# EAGLE design MI0283QT_v13 (EAGLE 6.6.0)
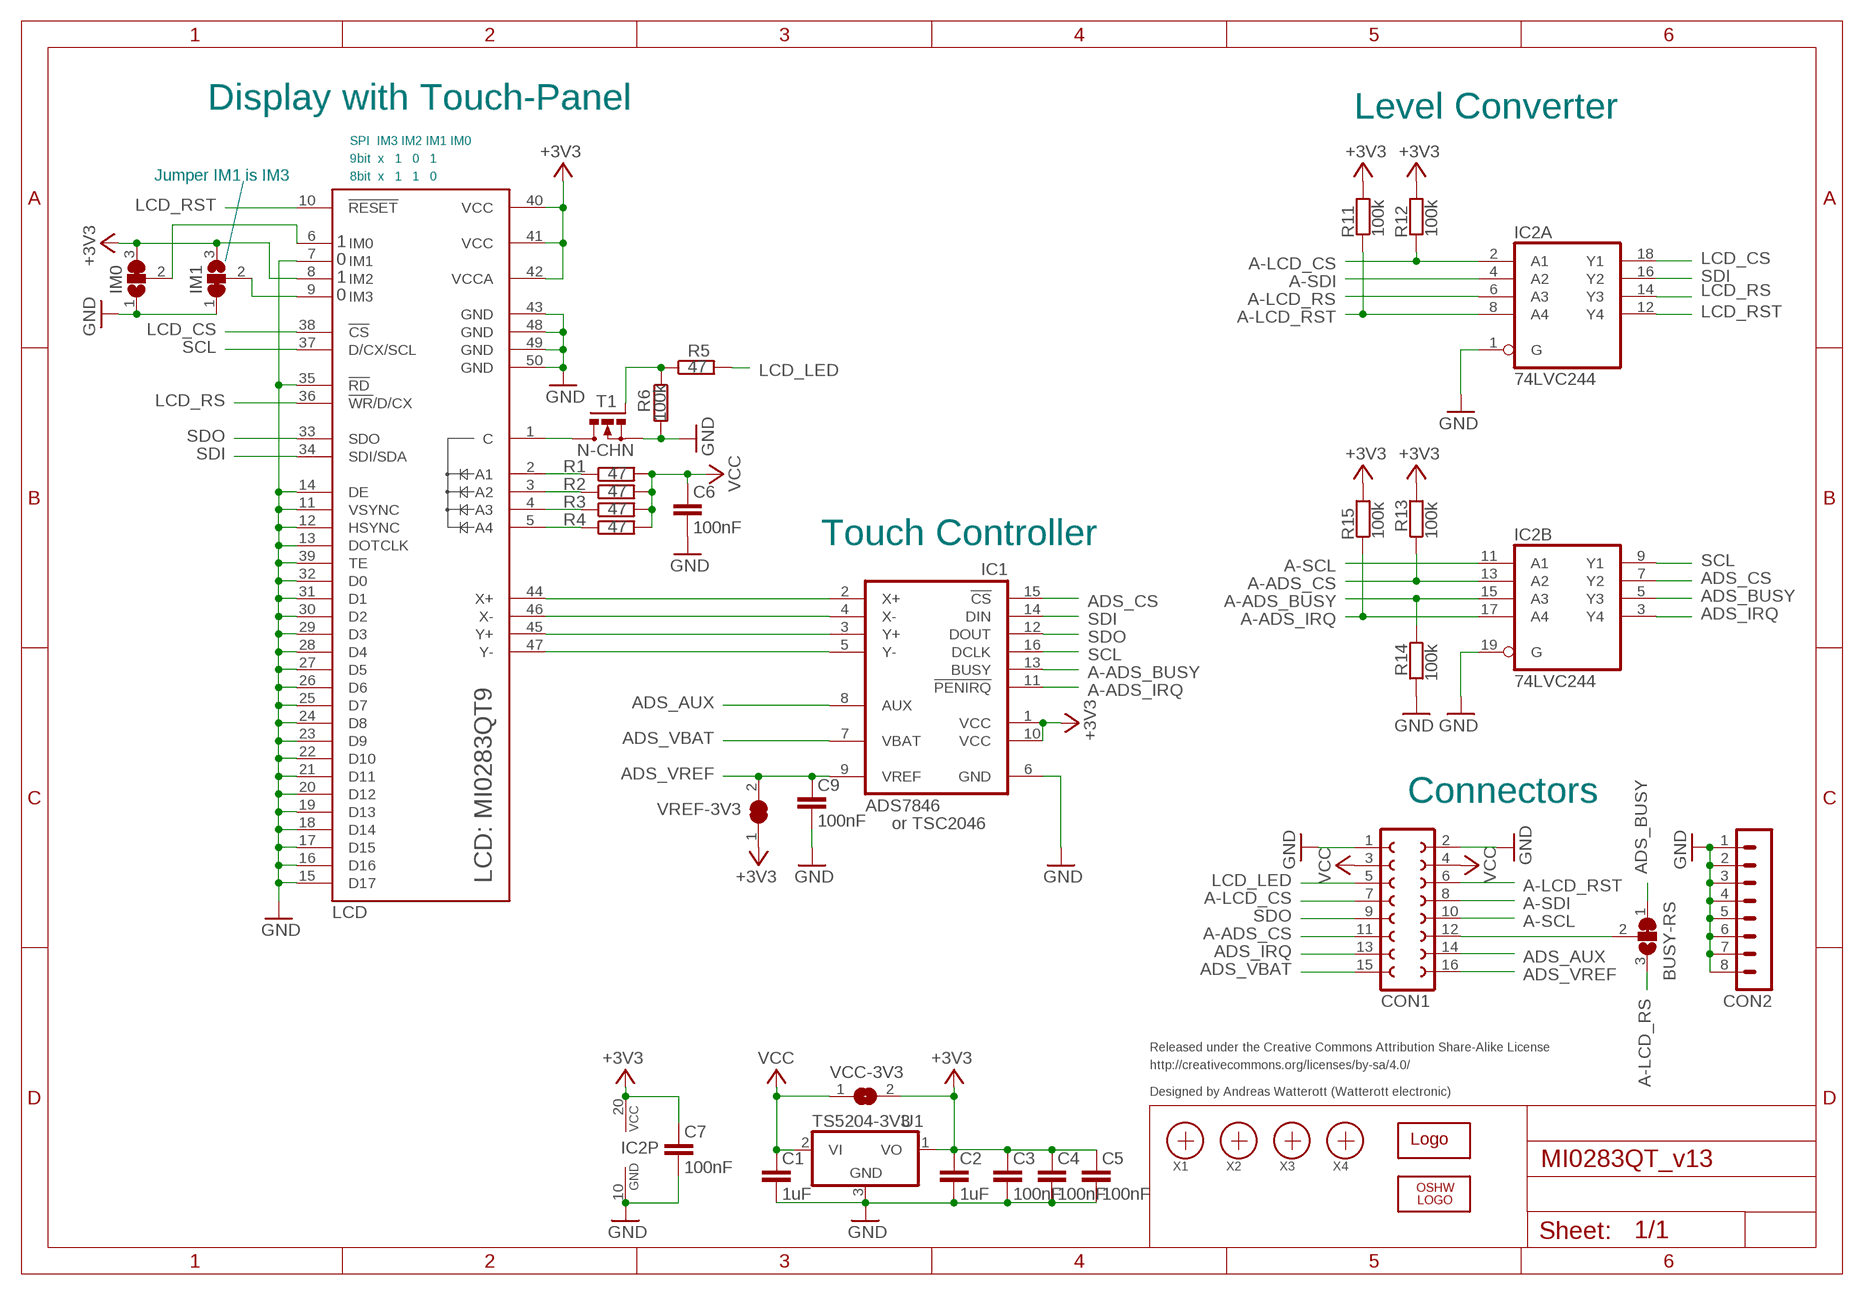
[diagram p0: schematic, sheet 1]

## Parts
BUSY-RS  SJ2W  [SJ_2]
C1  1uF  C-EUC0603  [C0603]
C2  1uF  C-EUC0603  [C0603]
C3  100nF  C-EUC0603  [C0603]
C4  100nF  C-EUC0603  [C0603]
C5  100nF  C-EUC0603  [C0603]
C6  100nF  C-EUC0603  [C0603]
C7  100nF  C-EUC0603  [C0603]
C9  100nF  C-EUC0603  [C0603]
CON1  FE08-2  [FE08-2]
CON2  MA08-1  [MA08-1]
IC1  ADS7846  [SSOP16]
IC2  74LVC244  74HC244DW  [SO20W]
IM0  SJ2W  [SJ_2]
IM1  SJ2W  [SJ_2]
LCD  MI0283QT9  [MI0283QT9]
LOGO1  OSHW_LOGO_6MILX0150-NT  [OSHW_6X150_NOTEXT]
R1  47  R-EU_R0603  [R0603]
R2  47  R-EU_R0603  [R0603]
R3  47  R-EU_R0603  [R0603]
R4  47  R-EU_R0603  [R0603]
R5  47  R-EU_R0603  [R0603]
R6  100k  R-EU_R0603  [R0603]
R11  100k  R-EU_R0603  [R0603]
R12  100k  R-EU_R0603  [R0603]
R13  100k  R-EU_R0603  [R0603]
R14  100k  R-EU_R0603  [R0603]
R15  100k  R-EU_R0603  [R0603]
T1  N-CHN  IRLML2502  [MICRO3]
U1  TS5204-3V3  TS5204  [SOT23]
U$1  WE-LOGO  WE-LOGOPLACE  [WE-LOGO]
VCC-3V3  SJ  [SJ]
VREF-3V3  SJ  [SJ]
X1  PASSER  [PASSER]
X2  PASSER  [PASSER]
X3  PASSER  [PASSER]
X4  PASSER  [PASSER]

## Nets
+3V3: C2.1 C3.1 C4.1 C5.1 C7.1 IC1.1(VCC) IC1.10(VCC) IC2.20(P:VCC) IM0.3 IM1.3 LCD.8(IM2) LCD.40(VCC) LCD.41(VCC) LCD.42(VCCA) R11.2 R12.2 R13.2 R15.2 U1.1(VO) VCC-3V3.2 VREF-3V3.1
A-ADS_BUSY: IC1.13(BUSY) IC2.15(B:A3) R14.1
A-ADS_CS: CON1.11 IC2.13(B:A2) R13.1
A-ADS_IRQ: IC1.11(!PENIRQ) IC2.17(B:A4) R15.1
A-LCD_CS: CON1.7 IC2.2(A:A1) R12.1
A-LCD_RS: BUSY-RS.3 IC2.6(A:A3)
A-LCD_RST: CON1.6 IC2.8(A:A4) R11.1
A-SCL: CON1.10 IC2.11(B:A1)
A-SDI: CON1.8 IC2.4(A:A2)
ADS_AUX: CON1.14 IC1.8(AUX)
ADS_BUSY: BUSY-RS.1 IC2.5(B:Y3)
ADS_CS: IC1.15(!CS) IC2.7(B:Y2)
ADS_IRQ: CON1.13 IC2.3(B:Y4)
ADS_VBAT: CON1.15 IC1.7(VBAT)
ADS_VREF: C9.1 CON1.16 IC1.9(VREF) VREF-3V3.2
C: LCD.1(C) T1.3(D)
GND: C1.2 C2.2 C3.2 C4.2 C5.2 C6.2 C7.2 C9.2 CON1.1 CON1.2 CON2.1 CON2.2 CON2.3 CON2.4 CON2.5 CON2.6 CON2.7 CON2.8 IC1.6(GND) IC2.1(A:G) IC2.10(P:GND) IC2.19(B:G) IM0.1 IM1.1 LCD.7(IM1) LCD.11(VSYNC) LCD.12(HSYNC) LCD.13(DOTCLK) LCD.14(DE) LCD.15(D17) LCD.16(D16) LCD.17(D15) LCD.18(D14) LCD.19(D13) LCD.20(D12) LCD.21(D11) LCD.22(D10) LCD.23(D9) LCD.24(D8) LCD.25(D7) LCD.26(D6) LCD.27(D5) LCD.28(D4) LCD.29(D3) LCD.30(D2) LCD.31(D1) LCD.32(D0) LCD.35(!RD) LCD.39(TE) LCD.43(GND) LCD.48(GND) LCD.49(GND) LCD.50(GND) R6.2 R14.2 T1.2(S) U1.3(GND)
IM0: IM0.2 LCD.6(IM0)
LCD_CS: IC2.18(A:Y1) LCD.38(!CS)
LCD_LED: CON1.5 R5.2
LCD_RS: IC2.14(A:Y3) LCD.36(!WR!/D/CX)
LCD_RST: IC2.12(A:Y4) LCD.10(!RESET)
LED_A1: LCD.2(A1) R1.1
LED_A2: LCD.3(A2) R2.1
LED_A3: LCD.4(A3) R3.1
LED_A4: LCD.5(A4) R4.1
LEDPWM: R5.1 R6.1 T1.1(G)
N$1: IC1.5(Y-) LCD.47(Y-)
N$2: IC1.3(Y+) LCD.45(Y+)
N$3: IC1.4(X-) LCD.46(X-)
N$4: IC1.2(X+) LCD.44(X+)
N$5: IM1.2 LCD.9(IM3)
N$6: BUSY-RS.2 CON1.12
SCL: IC1.16(DCLK) IC2.9(B:Y1) LCD.37(D/CX/SCL)
SDI: IC1.14(DIN) IC2.16(A:Y2) LCD.34(SDI/SDA)
SDO: CON1.9 IC1.12(DOUT) LCD.33(SDO)
VCC: C1.1 C6.1 CON1.3 CON1.4 R1.2 R2.2 R3.2 R4.2 U1.2(VI) VCC-3V3.1

## Notes on the sheet
- Display with Touch-Panel | Level Converter
- SPI  IM3 IM2 IM1 IM0
- 9bit  x   1   0   1
- Jumper IM1 is IM3 | 8bit  x   1   1   0
- 1
- 0
- 1
- 0
- Touch Controller
- Connectors
- or TSC2046
- Released under the Creative Commons Attribution Share-Alike License
- http://creativecommons.org/licenses/by-sa/4.0/
- Designed by Andreas Watterott (Watterott electronic)

## Library data of the parts
BUSY-RS IM0 IM1 = jumper:SJ2W: SMD solder JUMPER
C1-C7 C9 = rcl:C-EU: CAPACITOR, European symbol
CON1 = con-lsta:FE08-2: FEMALE HEADER
CON2 = con-lstb:MA08-1: PIN HEADER; OC_FARNELL: unknown; OC_NEWARK: unknown
IC1 = Display:ADS7846: ADS7846 Touch Screen Controller
IC2 = 74xx-eu:74*244: Octal BUFFER and LINE DRIVER, 3-state
LCD = Display:MI0283QT9: Multi-Inno MIO283QT9 LCD (240x320) with Ilitek ILI9341 controller
LOGO1 = OSHW:OSHW_LOGO_6MIL
R1-R6 R11-R15 = rcl:R-EU_: RESISTOR, European symbol
T1 = IRF-sot23:IRLML2502: N-Channel Power MOSFET
U1 = Voltage-Reg:TS5204
U$1 = welectronic:WE-LOGO
VCC-3V3 VREF-3V3 = jumper:SJ: SMD solder JUMPER
X1-X4 = SMD:PASSER

## Board
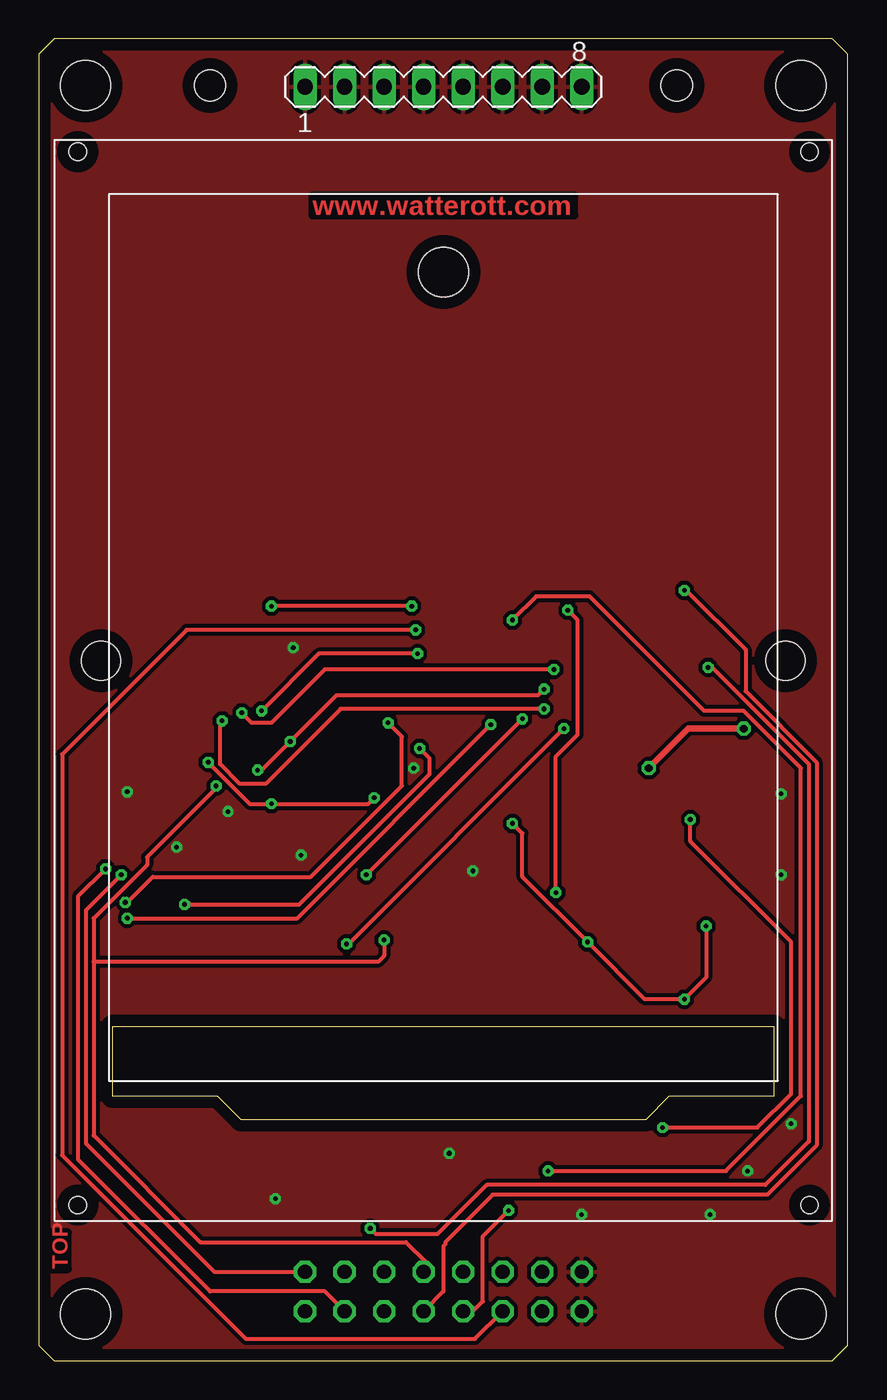
[diagram p1: board, top side]
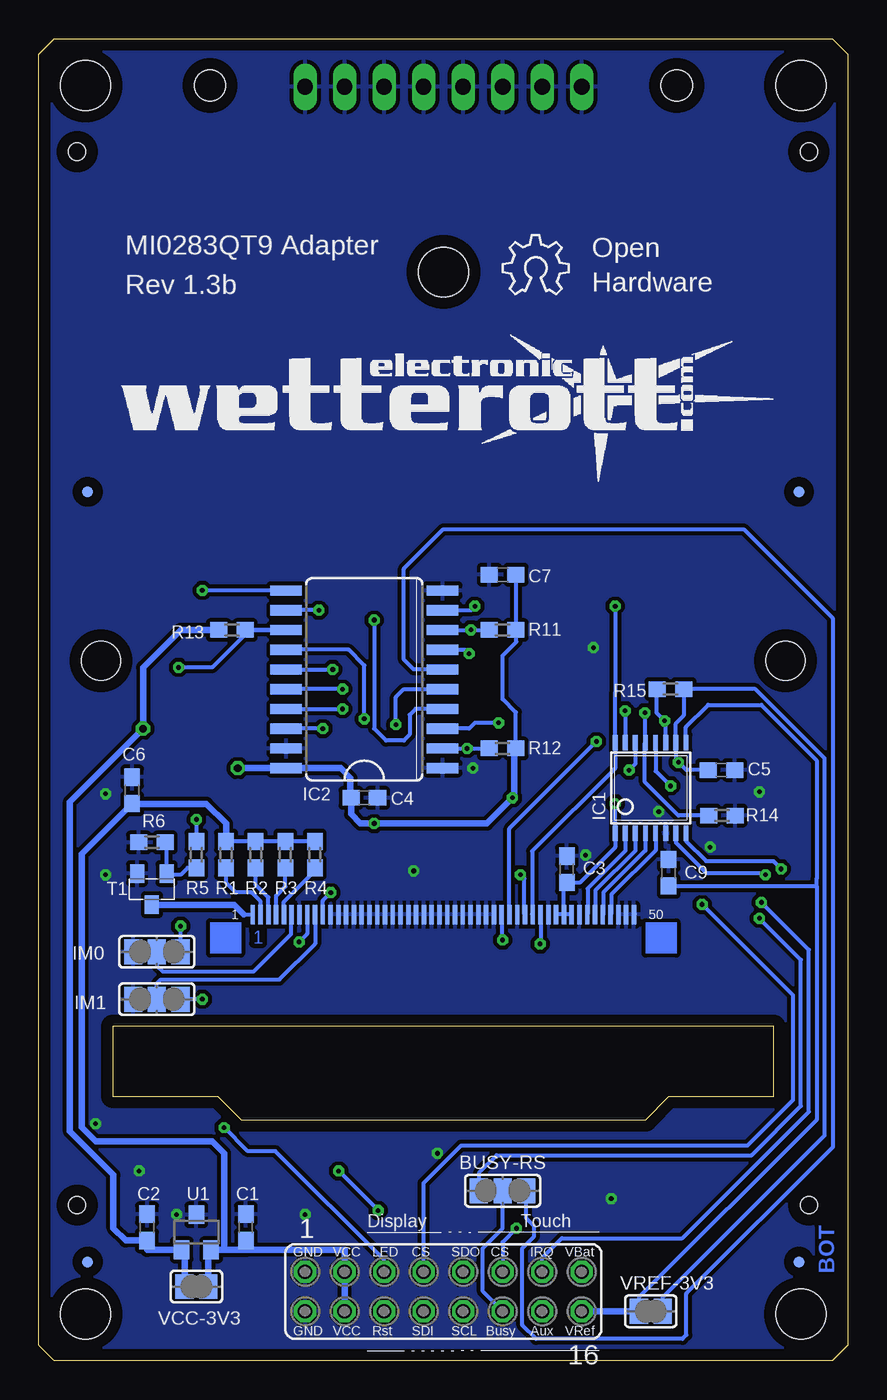
[diagram p2: board, bottom side, seen from below]

Size 52 x 85 mm. Coordinates in mm from the lower left corner, seen from the top.
Outline: 0,1 1,0 51,0 52,1 52,84 51,85 1,85 0,84 0,1
Copper layers (1*16): Top 0.035mm / dielectric 1.5mm / Bottom 0.035mm
Design rules "default *": minimum track width 6mil, minimum drill 0.3mm, track to track 6mil, track to pad 6mil, pad to pad 6mil, via to via 6mil, smd to smd 6mil, copper to edge 30mil, drill to drill 8mil, minimum pad ring 10mil, minimum via ring 8mil, stop-mask expansion 4mil, vias tented up to drill 0.6mm, thermal gap 10mil
Holes 3.2 mm at 3,3 49,3 3,82 49,82 26,70
Holes 2 mm at 41,82 11,82
Holes 2.5 mm at 4,45 48,45

### Footprints (pad centres in the part's own frame; a part is rotated, then mirrored left to right if it is on the bottom)
SJ_2 = smd 1.168 x 1.6: 1 -1.524,0; 2 0,0; 3 1.524,0
C0603 = smd 1.1 x 1: 1 -0.85,0; 2 0.85,0
FE08-2 = drill 0.914 octagon: 1 -8.89,1.27; 2 -8.89,-1.27; 3 -6.35,1.27; 4 -6.35,-1.27; 5 -3.81,1.27; 6 -3.81,-1.27; 7 -1.27,1.27; 8 -1.27,-1.27; 9 1.27,1.27; 10 1.27,-1.27; 11 3.81,1.27; 12 3.81,-1.27; 13 6.35,1.27; 14 6.35,-1.27; 15 8.89,1.27; 16 8.89,-1.27
MA08-1 = drill 1.016 long: 1 -8.89,0; 2 -6.35,0; 3 -3.81,0; 4 -1.27,0; 5 1.27,0; 6 3.81,0; 7 6.35,0; 8 8.89,0
SSOP16 = smd 0.305 x 0.991: 1 -2.925,-2.918; 2 -2.275,-2.918; 3 -1.625,-2.918; 4 -0.975,-2.918; 5 -0.325,-2.918; 6 0.325,-2.918; 7 0.975,-2.918; 8 1.625,-2.918; 9 1.625,2.918; 10 0.975,2.918; 11 0.325,2.918; 12 -0.325,2.918; 13 -0.975,2.918; 14 -1.625,2.918; 15 -2.275,2.918; 16 -2.925,2.918
SO20W = smd 0.66 x 2.032: 1 -5.715,-5.029; 2 -4.445,-5.029; 3 -3.175,-5.029; 4 -1.905,-5.029; 5 -0.635,-5.029; 6 0.635,-5.029; 7 1.905,-5.029; 8 3.175,-5.029; 9 4.445,-5.029; 10 5.715,-5.029; 11 5.715,5.029; 12 4.445,5.029; 13 3.175,5.029; 14 1.905,5.029; 15 0.635,5.029; 16 -0.635,5.029; 17 -1.905,5.029; 18 -3.175,5.029; 19 -4.445,5.029; 20 -5.715,5.029
MI0283QT9 = smd 0.279 x 1.27 bottom: 1 12.25,19.683; 2 11.75,19.683; 3 11.25,19.683; 4 10.75,19.683; 5 10.25,19.683; 6 9.75,19.683; 7 9.25,19.683; 8 8.75,19.683; 9 8.25,19.683; 10 7.75,19.683; 11 7.25,19.683; 12 6.75,19.683; 13 6.25,19.683; 14 5.75,19.683; 15 5.25,19.683; 16 4.75,19.683; 17 4.25,19.683; 18 3.75,19.683; 19 3.25,19.683; 20 2.75,19.683; 21 2.25,19.683; 22 1.75,19.683; 23 1.25,19.683; 24 0.75,19.683; 25 0.25,19.683; 26 -0.25,19.683; 27 -0.75,19.683; 28 -1.25,19.683; 29 -1.75,19.683; 30 -2.25,19.683; 31 -2.75,19.683; 32 -3.25,19.683; 33 -3.75,19.683; 34 -4.25,19.683; 35 -4.75,19.683; 36 -5.25,19.683; 37 -5.75,19.683; 38 -6.25,19.683; 39 -6.75,19.683; 40 -7.25,19.683; 41 -7.75,19.683; 42 -8.25,19.683; 43 -8.75,19.683; 44 -9.25,19.683; 45 -9.75,19.683; 46 -10.25,19.683; 47 -10.75,19.683; 48 -11.25,19.683; 49 -11.75,19.683; 50 -12.25,19.683 | hole 1.1: 23.54,1; -23.5,1; 23.54,68.75; -23.5,68.75
R0603 = smd 1.1 x 1: 1 -0.85,0; 2 0.85,0
MICRO3 = smd 0.9 x 1.2: 1 -0.95,-1; 2 0.95,-1; 3 0,1
SOT23 = smd 1 x 1.2: 1 -0.95,-1.132; 2 0.95,-1.132; 3 0,1.132
SJ = smd 1.168 x 1.6: 1 -0.762,0; 2 0.762,0
PASSER = smd 0.7 x 0.7: X 0,0

### Placement (x,y rotation side)
BUSY-RS  22.19,10.92 0 bottom
C1  38.7,8.57 90 bottom
C2  45.05,8.57 90 bottom
C3  18.06,31.59 90 bottom
C4  31.08,36.2 0 bottom
C5  8.12,37.97 0 bottom
C6  46,36.67 90 bottom
C7  22.19,50.55 180 bottom
C9  11.52,31.37 90 bottom
CON1  26,4.45 0 bottom
CON2  26,81.92 0 top
IC1  12.03,36.83 0 bottom
IC2  31.08,43.81 90 bottom
IM0  44.41,26.29 0 bottom
IM1  44.41,23.24 0 bottom
LCD  26,9 0 top
LOGO1  22.19,68.58 0 bottom
R1  39.97,32.54 90 bottom
R2  38.06,32.54 90 bottom
R3  36.16,32.54 90 bottom
R4  34.26,32.54 90 bottom
R5  41.88,32.54 90 bottom
R6  44.73,33.34 180 bottom
R11  22.19,46.99 0 bottom
R12  22.19,39.37 0 bottom
R13  39.59,46.99 180 bottom
R14  8.09,35.05 0 bottom
R15  11.39,43.18 0 bottom
T1  44.73,30.32 180 bottom
U1  41.88,8.26 0 bottom
U$1  46.95,56.2 0 bottom
VCC-3V3  41.88,4.76 180 bottom
VREF-3V3  12.66,3.17 180 bottom
X1  3.14,6.35 0 bottom
X2  3.14,55.88 0 bottom
X3  48.86,55.88 0 bottom
X4  48.86,6.35 0 bottom

### Tracks (layer width: path | path; a pad name or v marks a point on that pad's centre or on a via)
+3V3  (via drill 0.3, 0.5)
  Top 0.254: v10.89,38.48 13.55,35.81 v14.95,35.81 21.17,35.81 v21.55,36.2 | v42.89,27.94 42.89,24.64 v41.49,23.24 38.95,23.24 v35.27,26.92 | 30.7,34.29 v30.45,34.54 31.08,33.91 31.08,31.11 v35.27,26.92 | 35.27,26.67 v35.27,26.92
  Top 0.406: v45.3,40.64 41.75,40.64 v39.21,38.1
  Bottom 0.254: R12.2 21.34,41.7 22.19,42.55 22.19,45.34 21.3,46.23 21.3,46.95 R11.2 C7.1 | LCD.41 18.25,30.55 C3.1 17.24,30.73 14.96,33.02 IC1.1 v14.95,35.81 | LCD.42 LCD.41 | LCD.41 LCD.40 | IC1.10 11.05,40.98 10.54,41.49 R15.2 5.93,43.18 1.49,38.73 1.49,14.48 11.9,4.06 VREF-3V3.1 | C5.1 10.38,37.97 v10.89,38.48 11.01,38.61 | 11.01,38.61 11.01,39.71 IC1.10 | IC1.10 11.05,38.65 11.01,38.61 | IM0.3 v42.89,27.94 | v41.49,23.24 IM1.3 | LCD.8 34.75,27.45 v35.27,26.92
  Bottom 0.406: VCC-3V3.2 42.64,7.12 U1.1 45.05,7.12 C2.1 46.42,7.72 47.21,8.51 47.21,11.94 50,14.73 50,35.94 v45.3,40.64 45.3,44.58 42.89,46.99 R13.2 | v39.21,38.1 IC2.20 32.6,38.1 31.97,37.47 31.97,36.23 C4.1 31.93,35.14 31.33,34.54 v30.45,34.54 23.21,34.54 v21.55,36.2 21.43,36.32 21.43,39.28 R12.2
A-ADS_BUSY  (via drill 0.3)
  Top 0.254: v33.11,44.45 18.38,44.45 14.95,41.02 13.68,41.02 v13.05,41.66
  Bottom 0.254: IC2.15 v33.11,44.45 | v13.05,41.66 13.05,39.79 IC1.13 13.05,39.71 13.05,37.21 10.89,35.05 R14.1
A-ADS_CS  (via drill 0.3)
  Top 0.254: v43.02,44.58 43.27,44.58 49.5,38.35 49.5,14.1 46.7,11.3 28.79,11.3 25.62,8.13 21.68,8.13 v21.3,8.51
  Bottom 0.254: R13.1 IC2.13 38.45,46.99 40.86,44.58 v43.02,44.58 | v21.3,8.51 22.19,7.62 CON1.11
A-ADS_IRQ  (via drill 0.3)
  Top 0.254: v32.48,41.91 19.4,41.91 14.57,37.08 12.92,37.08 11.65,38.35 11.65,41.02 v11.78,41.15
  Bottom 0.254: IC1.11 11.71,41.08 v11.78,41.15 11.97,41.34 12.28,41.66 12.28,43.14 R15.1 | IC2.17 v32.48,41.91
A-LCD_CS  (via drill 0.3)
  Top 0.254: v9.36,29.34 16.73,29.34 25.11,37.72 25.11,38.73 v24.48,39.37
  Bottom 0.254: IC2.2 v24.48,39.37 R12.1 | CON1.7 27.27,11.43 24.86,13.84 6.44,13.84 3.52,16.76 3.52,23.5 v9.36,29.34
A-LCD_RS
  Bottom 0.254: IC2.6 27.91,44.45 28.54,45.09 28.54,50.93 26,53.47 6.7,53.47 0.98,47.75 0.98,13.72 10.38,4.32 10.38,1.65 10.63,1.4 20.03,1.4 20.92,2.29 20.92,7.24 20.16,8 20.16,8.64 20.67,9.14 BUSY-RS.3
A-LCD_RST  (via drill 0.3)
  Top 0.254: v24.22,46.99 9.49,46.99 1.49,38.99 1.49,13.21 5.36,9.34 5.55,9.14 13.3,1.4 28.03,1.4 CON1.6
  Bottom 0.254: R11.1 v24.22,46.99 IC2.8
A-SCL  (via drill 0.3)
  Top 0.254: v41.49,49.53 41.62,49.53 45.43,45.72 45.43,43.05 50,38.48 50,13.84 46.83,10.67 29.18,10.67 26.13,7.62 26.13,7.49 26,7.37 26,4.45 CON1.10
  Bottom 0.254: IC2.11 v41.49,49.53
A-SDI  (via drill 0.3)
  Top 0.254: CON1.8 27.91,3.17 28.54,3.81 28.54,8 v30.19,9.65 | v32.73,12.19 44.16,12.19 48.99,17.02 48.99,38.1 45.3,41.78 42.76,41.78 35.4,49.15 31.97,49.15 v30.45,47.62
  Bottom 0.254: v30.19,9.65 v32.73,12.19 | v30.45,47.62 30.45,40.64 29.68,39.88 28.54,39.88 28.16,40.26 28.16,41.53 27.78,41.91 IC2.4
ADS_AUX  (via drill 0.3)
  Top 0.254: v4.28,31.62 2.5,29.84 2.5,12.95 11.01,4.45 18.38,4.45 CON1.14
  Bottom 0.254: IC1.8 10.4,33.43 9.11,32.13 4.79,32.13 v4.28,31.62
ADS_BUSY  (via drill 0.3)
  Top 0.254: v5.68,28.45 16.6,28.45 v29.05,40.89
  Bottom 0.15: BUSY-RS.1 22.44,10.92
  Bottom 0.254: v5.68,28.45 3.01,25.78 3.01,16.38 6.19,13.21 22.57,13.21 23.71,12.06 BUSY-RS.1 | v29.05,40.89 29.05,42.67 28.54,43.18 IC2.5
ADS_CS  (via drill 0.3)
  Top 0.254: v24.35,45.47 18,45.47 v14.32,41.78
  Bottom 0.254: IC2.7 24.6,45.72 v24.35,45.47 | v14.32,41.78 14.32,39.76 IC1.15
ADS_IRQ  (via drill 0.3)
  Top 0.254: v22.44,41.02 23.33,40.13 23.33,36.96 17.49,31.11 7.33,31.11 5.68,29.46 v5.55,29.46
  Bottom 0.254: CON1.13 19.65,6.6 18.38,7.87 10.63,7.87 2.5,16 2.5,26.42 v5.55,29.46 | v22.44,41.02 23.97,41.02 24.35,40.64 IC2.3
ADS_VBAT  (via drill 0.3)
  Top 0.254: v5.3,31.24 3.01,28.96 3.01,13.97 11.27,5.71 CON1.15
  Bottom 0.254: IC1.7 11.05,33.31 9.11,31.37 5.43,31.37 v5.3,31.24
ADS_VREF
  Bottom 0.254: IC1.9 10.4,40.74 8.98,42.16 5.55,42.16 2,38.61 2,30.99 2,30.52 | 2,30.52 2,15.49 13.43,4.06 VREF-3V3.2 | C9.1 2,30.52
  Bottom 0.406: CON1.16 VREF-3V3.2
C
  Bottom 0.254: 38.83,28.7 38.27,28.7 LCD.1
  Bottom 0.406: T1.3 39.45,29.32 38.83,28.7
GND  (via drill 0.3)
  Bottom 0.15: 46.07,23.24 44.54,23.24
  Bottom 0.254: LCD.11 | 32.22,28.71 LCD.13 | 45.58,31.42 T1.2 45.76,31.24 | 7.27,35.08 R14.2 | 13.68,28.75 LCD.50 | LCD.12 32.75,28.59 32.73,28.57 | IM1.1 46.07,23.24 | 44.92,9.55 C2.2 45.01,9.39
  Bottom 0.406: 30.19,36.23 C4.2
  other vias: 47.72,36.45 47.72,31.24 8.86,33.02 12.16,35.31 48.35,15.24 45.56,12.19 34.89,9.4 43.14,9.4 27.91,31.5 24.09,38.1 26.38,13.34 15.21,10.41 16.35,45.85 5.68,36.58 16.86,32.51
  pour Bottom (isolate 0.254): 0,85 52,85 52,0 0,0
  pour Top (isolate 0.254): 0,85 52,85 52,0 0,0
IM0
  Bottom 0.15: IM0.2 43.02,26.29
  Bottom 0.254: IM0.2 44.41,25.4 44.03,25.02 38.19,25.02 35.78,27.43 35.78,28.65 LCD.6
LCD_CS  (via drill 0.3)
  Top 0.254: v19.78,26.8 19.9,26.8 v33.75,40.64
  Bottom 0.254: LCD.38 19.75,26.82 v19.78,26.8 | v33.75,40.64 IC2.18
LCD_LED  (via drill 0.3)
  Top 0.254: v40.1,14.99 46.19,14.99 48.35,17.14 48.35,26.92 R5.2 v41.88,34.8
  Bottom 0.254: CON1.5 29.81,6.48 36.8,13.46 38.57,13.46 v40.1,14.99 | v41.88,34.8 R5.2
LCD_RS  (via drill 0.3)
  Top 0.254: v21.05,31.24 v31.08,41.27
  Bottom 0.254: LCD.36 20.79,28.68 20.79,30.99 v21.05,31.24 | v31.08,41.27 31.08,44.7 32.1,45.72 IC2.14
LCD_RST  (via drill 0.3)
  Top 0.254: v33.24,30.1 33.24,38.86 34.64,40.26 34.64,47.62 v34,48.26
  Bottom 0.254: LCD.10 33.75,29.59 v33.24,30.1 | v34,48.26 IC2.12
LED_A1
  Bottom 0.254: LCD.2 37.75,29.53 38.32,30.1 39.34,30.1 39.97,30.73 R1.1
LED_A2
  Bottom 0.254: LCD.3 37.25,29.79 38.06,30.61 R2.1
LED_A3
  Bottom 0.254: LCD.4 36.75,29.89 36.16,30.48 R3.1
LED_A4
  Bottom 0.254: LCD.5 36.25,29.5 34.26,31.5 R4.1
LEDPWM
  Bottom 0.254: R6.1 43.78,33.24 T1.1 43.7,31.24 42.89,31.24 42.44,31.69 R5.1
N$1
  Bottom 0.254: IC1.5 12.36,32.82 15.21,29.97 15.21,28.73 LCD.47
N$2
  Bottom 0.254: IC1.3 13.65,32.79 16.22,30.23 16.22,28.71 LCD.45
N$3
  Bottom 0.254: IC1.4 13.01,32.81 15.71,30.1 15.71,28.72 LCD.46
N$4
  Bottom 0.254: IC1.2 14.3,32.78 16.73,30.35 16.73,28.7 LCD.44
N$5
  Bottom 0.254: IM1.2 44.41,24.26 44.16,24.51 36.54,24.51 34.25,26.8 LCD.9
N$6
  Bottom 0.254: CON1.12 23.46,4.45 23.46,7.24 22.19,8.51 BUSY-RS.2
N$7
  Bottom 0.15: 13.3,3.17 12.16,3.17
SCL  (via drill 0.3)
  Top 0.254: v23.97,48.51 v14.95,48.51
  Bottom 0.254: IC2.9 24.22,48.26 v23.97,48.51 | v14.95,48.51 14.95,42.93 14.96,42.93 IC1.16 14.96,38.1 20.29,32.77 20.29,28.72 LCD.37
SDI  (via drill 0.3)
  Top 0.254: v14.06,37.97 14.32,37.97 16.03,39.69 v16.16,39.81 19.14,42.8 32.1,42.8 v32.48,43.18
  Bottom 0.254: IC1.14 13.65,38.38 v14.06,37.97 | v32.48,43.18 IC2.16 | LCD.34 21.75,34.22 v16.16,39.81
SDO  (via drill 0.3)
  Top 0.254: v11.39,36.96 11.39,36.83 6.95,32.38 6.95,31.88 3.52,28.45 3.52,25.65 | 3.52,25.65 3.52,14.48 10.38,7.62 23.59,7.62 24.86,6.35 24.86,5.84 CON1.9 | v22.19,27.05 22.19,26.04 21.81,25.65 3.52,25.65
  Bottom 0.254: IC1.12 12.36,37.92 v11.39,36.96 | LCD.33 22.25,27.11 v22.19,27.05
VCC
  Bottom 0.254: R4.2 R3.2 R2.2 R1.2
  Bottom 0.406: R1.2 39.97,34.54 41.24,35.81 C6.1 49.24,32.58 49.24,14.99 48.35,14.1 40.86,14.1 40.1,13.34 40.1,7.11 38.83,7.11 | 38.83,7.12 U1.2 41.11,7.12 VCC-3V3.1 | 38.83,7.12 38.7,7.12 38.7,7.24 | CON1.4 CON1.3 32.35,7.11 38.83,7.11 | 38.83,7.11 38.83,7.12 | C1.1 38.7,7.24 | 38.7,7.24 38.83,7.24 38.83,7.12

### Text on the board
Top: www.watterott.com | TOP
Bottom: 1 | BOT
bPlace: Open | MI0283QT9 Adapter | Hardware | Rev 1.3b | Touch | Display | VBat | IRQ | CS | SDO | CS | LED | VCC | GND | VRef | Aux | Busy | SCL | SDI | Rst | VCC | GND
Reference: Silkscreen: 22 bPlace + 26 bNames